# EAGLE design Board-Back (EAGLE 9.0.1)
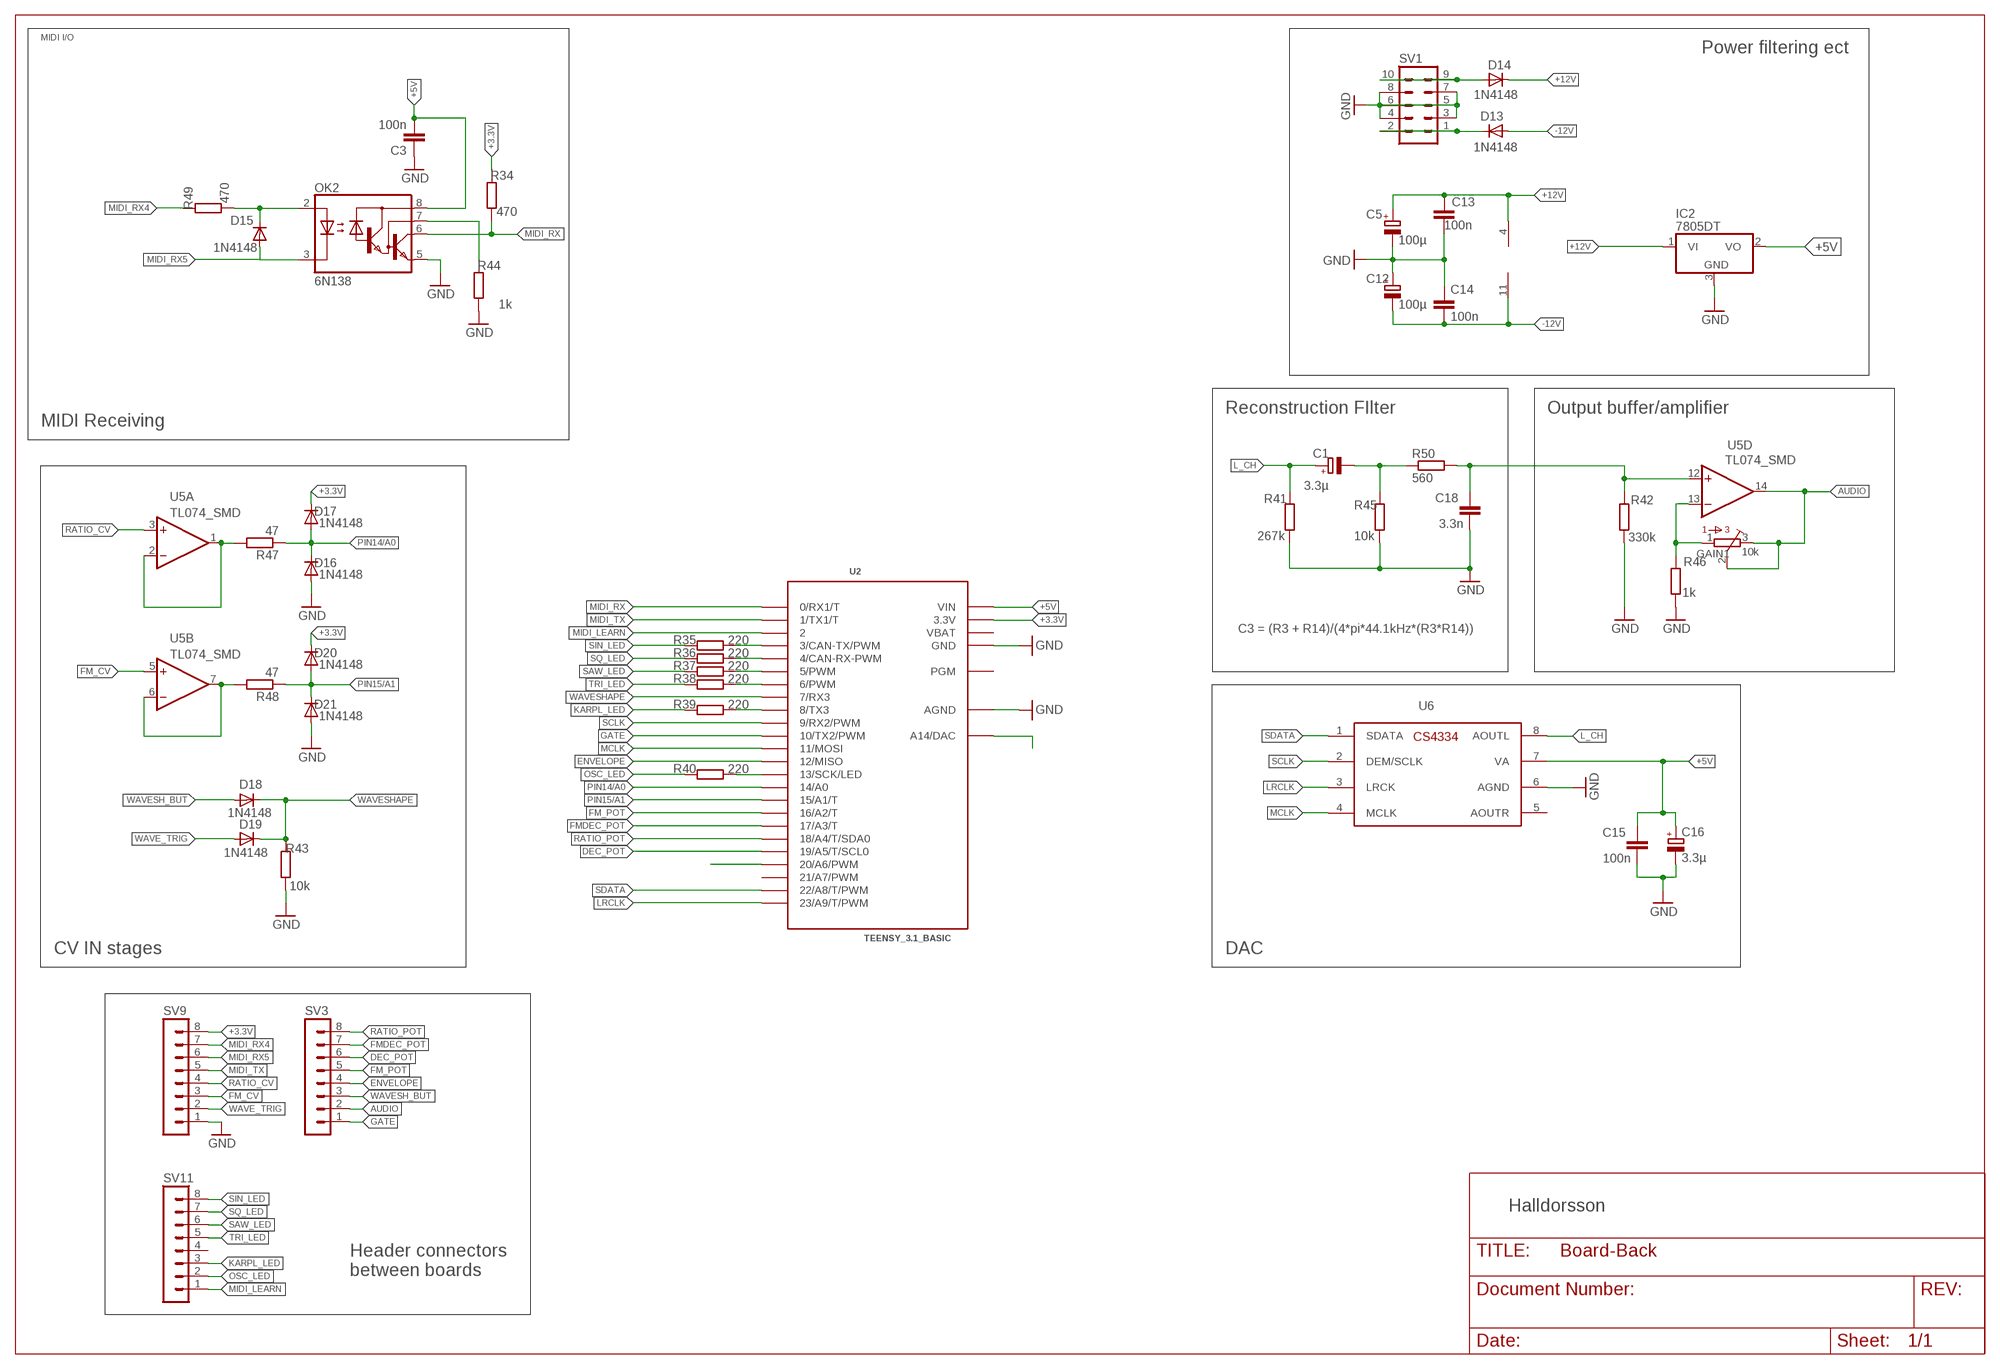
[diagram p0: schematic, sheet 1]

## Parts
C1  3.3µ  CPOL-EU153CLV-0405  [153CLV-0405]
C3  100n  C-EUC1206  [C1206]
C5  100µ  CPOL-EUE5-6  [E5-6]
C12  100µ  CPOL-EUE5-6  [E5-6]
C13  100n  C-EUC1206  [C1206]
C14  100n  C-EUC1206  [C1206]
C15  100n  C-EUC1206  [C1206]
C16  3.3µ  CPOL-EU153CLV-0505  [153CLV-0505]
C18  3.3n  C-EUC1206  [C1206]
D13  1N4148  1N4148DO35-7  [DO35-7]
D14  1N4148  1N4148DO35-7  [DO35-7]
D15  1N4148  1N4148DO35-7  [DO35-7]
D16  1N4148  1N4148DO35-7  [DO35-7]
D17  1N4148  1N4148DO35-7  [DO35-7]
D18  1N4148  1N4148DO35-7  [DO35-7]
D19  1N4148  1N4148DO35-7  [DO35-7]
D20  1N4148  1N4148DO35-7  [DO35-7]
D21  1N4148  1N4148DO35-7  [DO35-7]
GAIN1  10k  BOURNS_3362P_TRIMMERP  [BOURNS_3362P_TRIMMER]
IC2  7805DT  [TO252]
OK2  6N138  [DIL08]
R34  470  R-EU_M1206  [M1206]
R35  220  R-EU_M1206  [M1206]
R36  220  R-EU_M1206  [M1206]
R37  220  R-EU_M1206  [M1206]
R38  220  R-EU_M1206  [M1206]
R39  220  R-EU_M1206  [M1206]
R40  220  R-EU_M1206  [M1206]
R41  267k  R-EU_M1206  [M1206]
R42  330k  R-EU_M1206  [M1206]
R43  10k  R-EU_M1206  [M1206]
R44  1k  R-EU_M1206  [M1206]
R45  10k  R-EU_M1206  [M1206]
R46  1k  R-EU_M1206  [M1206]
R47  47  R-EU_M1206  [M1206]
R48  47  R-EU_M1206  [M1206]
R49  470  R-EU_M1206  [M1206]
R50  560  R-EU_M1206  [M1206]
SV1  10PIN_BACKSIDE  [10PIN_BACKSIDE]
SV3  MA08-1  [MA08-1]
SV9  MA08-1  [MA08-1]
SV11  MA08-1  [MA08-1]
U2  TEENSY_3.1_BASIC  [TEENSY_3.1_BASIC]
U5  TL074_SMD  [SO14]
U6  CS4334  [SOIC127P600X175-8N]

## Nets
+3.3V: D17.C D20.C R34.2 SV9.8 U2.3.3V U2.3.3V1(3.3V)
+5V: C3.2 C15.1 C16.+ IC2.2(VO) OK2.8(VCC) U2.VIN U6.7(VA)
+12V: C5.+ C13.1 D14.C IC2.1(VI) U5.4(P:V+)
-12V: C12.- C14.2 D13.A U5.11(P:V-)
AUDIO: GAIN1.2 GAIN1.3 SV3.2 U5.14(D:OUT)
DEC_POT: SV3.6 U2.19/A5(19/A5/T/SCL0)
ENVELOPE: SV3.4 U2.12(12/MISO)
FM_CV: SV9.3 U5.5(B:+IN)
FM_POT: SV3.5 U2.16/A2(16/A2/T)
FMDEC_POT: SV3.7 U2.17/A3(17/A3/T)
GATE: SV3.1 U2.10(10/TX2/PWM)
GND: C3.1 C5.- C12.+ C13.2 C14.1 C15.2 C16.- C18.2 D16.A D21.A IC2.3(GND) OK2.5(GND) R41.2 R42.2 R43.1 R44.1 R45.2 R46.2 SV1.3 SV1.4 SV1.5 SV1.6 SV1.7 SV1.8 SV9.1 U2.AGND U2.GND U2.GND1(GND) U6.6(AGND)
KARPL_LED: R39.2 SV11.3
L_CH: C1.+ R41.1 U6.8(AOUTL)
LRCLK: U2.23/A9(23/A9/T/PWM) U6.3(LRCK)
MCLK: U2.11(11/MOSI) U6.4(MCLK)
MIDI_LEARN: SV11.1 U2.2
MIDI_RX: OK2.6(VO) R34.1 U2.0(0/RX1/T)
MIDI_RX4: R49.2 SV9.7
MIDI_RX5: D15.A OK2.3(C) SV9.6
MIDI_TX: SV9.5 U2.1(1/TX1/T)
N$1: C1.- R45.1 R50.1
N$2: U2.A14(A14/DAC)
N$3: D13.C SV1.1 SV1.2
N$4: D15.C OK2.2(A) R49.1
N$5: OK2.7(VB) R44.2
N$6: U2.20/A6(20/A6/PWM)
N$8: GAIN1.1 R46.1 U5.13(D:-IN)
N$9: D14.A SV1.9 SV1.10
N$10: R40.1 U2.13(13/SCK/LED)
N$11: C18.1 R42.1 R50.2 U5.12(D:+IN)
N$12: R35.1 U2.3(3/CAN-TX/PWM)
N$14: R36.1 U2.4(4/CAN-RX-PWM)
N$15: R37.1 U2.5(5/PWM)
N$16: R48.2 U5.6(B:-IN) U5.7(B:OUT)
N$17: R47.2 U5.1(A:OUT) U5.2(A:-IN)
N$19: R38.1 U2.6(6/PWM)
N$22: R39.1 U2.8(8/TX3)
OSC_LED: R40.2 SV11.2
PIN14/A0: D16.C D17.A R47.1 U2.14/A0
PIN15/A1: D20.A D21.C R48.1 U2.15/A1(15/A1/T)
RATIO_CV: SV9.4 U5.3(A:+IN)
RATIO_POT: SV3.8 U2.18/A4(18/A4/T/SDA0)
SAW_LED: R37.2 SV11.6
SCLK: U2.9(9/RX2/PWM) U6.2(DEM/SCLK)
SDATA: U2.22/A8(22/A8/T/PWM) U6.1(SDATA)
SIN_LED: R35.2 SV11.8
SQ_LED: R36.2 SV11.7
TRI_LED: R38.2 SV11.5
WAVE_TRIG: D19.A SV9.2
WAVESH_BUT: D18.A SV3.3
WAVESHAPE: D18.C D19.C R43.2 U2.7(7/RX3)
Unconnected: SV11.4 U2.21/A7(21/A7/PWM) U2.PGM U5.8(C:OUT) U5.9(C:-IN) U5.10(C:+IN) U6.5(AOUTR)

## Notes on the sheet
- MIDI I/O
- Power filtering ect
- Reconstruction FIlter | Output buffer/amplifier
- MIDI Receiving
- C3 = (R3 + R14)/(4*pi*44.1kHz*(R3*R14))
- CV IN stages | DAC
- Halldorsson
- Header connectors 
  between boards

## Power pins joined to a net without a drawn wire
VBAT: U2.VBAT

## Library data of the parts
C1 C5 C12 C16 = resistor:CPOL-EU: POLARIZED CAPACITOR, European symbol
C3 C13-C15 C18 = resistor:C-EU: CAPACITOR, European symbol
D13-D21 = diode:1N4148: DIODE high speed (Philips)
GAIN1 = MusicThingModular:BOURNS_3362P_TRIMMER: 3362 Series 1/4" Square Trimmer
IC2 = linear:78*: Positive VOLTAGE REGULATOR Source: http://cache.national.com/ds/LM/LM78L05.pdf http://www.fairchildsemi.com/ds/LM/LM7805.pdf
OK2 = optocoupler:6N138: MOTOROLA OPTO COUPLER; MF: VISHAY/TELEFUNKEN; MPN: 6N138; OC_FARNELL: 9860150; OC_NEWARK: 35K5294
R34-R50 = resistor:R-EU_: RESISTOR, European symbol
SV1 = MusicThingModular:10PIN_BACKSIDE: PIN HEADER; OC_FARNELL: unknown; OC_NEWARK: unknown
SV3 SV9 SV11 = con-lstb:MA08-1: PIN HEADER; OC_FARNELL: unknown; OC_NEWARK: unknown
U2 = Teensy_3_Series_Board_v1.0:TEENSY_3.1_BASIC: Footprint for Teensy 3.1 board using all pin connections on the outer perimeter
U5 = MusicThingModular:TL074: Generic Quad Op Amp
U6 = SOIC127P600X175-8N:CS4334

## Board
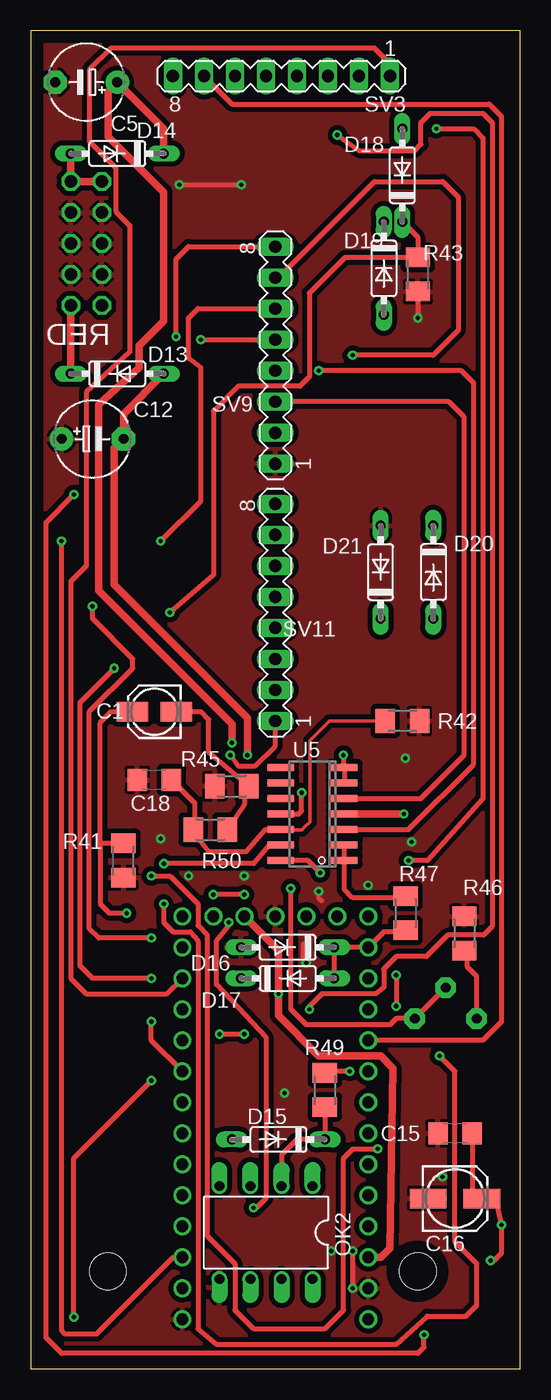
[diagram p1: board, top side]
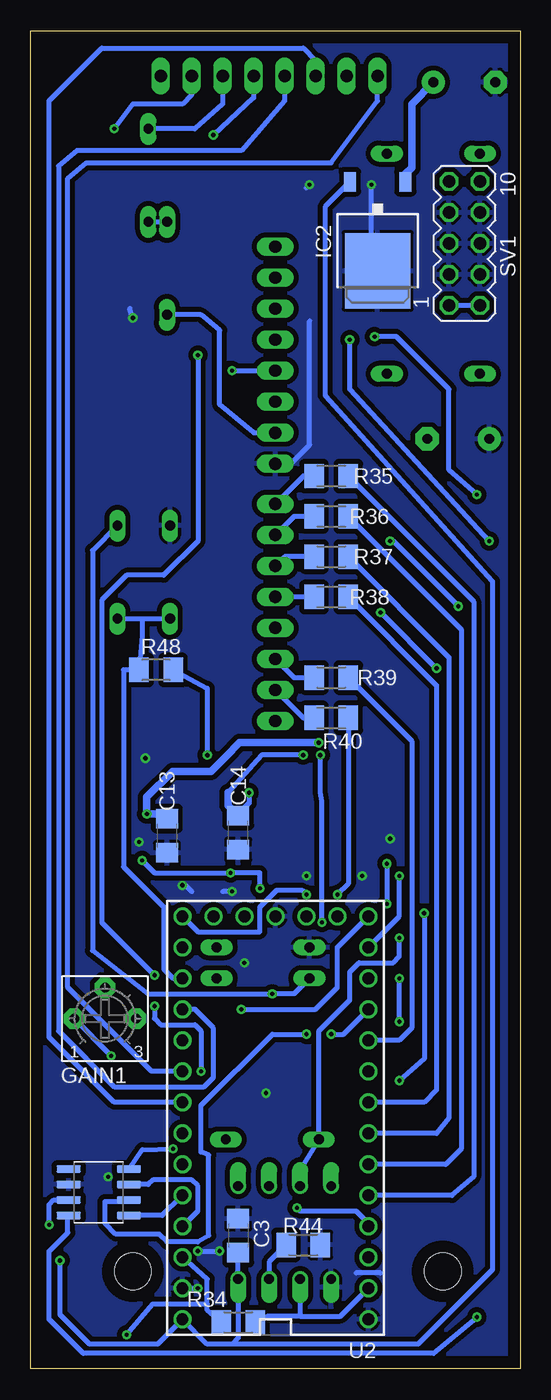
[diagram p2: board, bottom side, seen from below]

Size 40.14 x 109.65 mm. Coordinates in mm from the lower left corner, seen from the top.
Outline: 0,109.65 0,0 40.14,0 40.14,109.65 0,109.65
Copper layers (1*16): Top 0.035mm / dielectric 1.5mm / Bottom 0.035mm
Design rules "default": minimum track width 6mil, minimum drill 0.35mm, track to track 6mil, track to pad 6mil, pad to pad 6mil, via to via 6mil, smd to smd 6mil, copper to edge 40mil, drill to drill 6mil, minimum pad ring 10mil, minimum via ring 8mil, stop-mask expansion 4mil, vias tented up to drill 0mil, thermal gap 10mil
Holes 3 mm at 6.35,8 31.75,8

### Footprints (pad centres in the part's own frame; a part is rotated, then mirrored left to right if it is on the bottom)
153CLV-0405 = smd 2.6 x 1.6: + 1.8,0; - -1.8,0
C1206 = smd 1.6 x 1.8: 1 -1.4,0; 2 1.4,0
E5-6 = drill 0.813 pad 1.905: + -2.54,0 | drill 0.813 pad 1.905 octagon: - 2.54,0
153CLV-0505 = smd 3 x 1.6: + 2.2,0; - -2.2,0
DO35-7 = drill 0.813 long: A 3.81,0; C -3.81,0
BOURNS_3362P_TRIMMER = drill 0.813 pad 1.676 octagon: 1 -2.54,0; 2 0,2.54; 3 2.54,0
TO252 = smd 1 x 1.6: 1 -2.28,-4.8; 2 2.28,-4.8 | smd 5.4 x 6.2: 3 0,2.5
DIL08 = drill 0.813 offset: 1 -3.81,-3.81; 2 -1.27,-3.81; 3 1.27,-3.81; 4 3.81,-3.81; 5 3.81,3.81; 6 1.27,3.81; 7 -1.27,3.81; 8 -3.81,3.81
M1206 = smd 1.6 x 2: 1 -1.4,0; 2 1.4,0
10PIN_BACKSIDE = drill 1.016 octagon: 1 -5.08,-1.27; 2 -5.08,1.27; 3 -2.54,-1.27; 4 -2.54,1.27; 5 0,-1.27; 6 0,1.27; 7 2.54,-1.27; 8 2.54,1.27; 9 5.08,-1.27; 10 5.08,1.27
MA08-1 = drill 1.016 long: 1 -8.89,0; 2 -6.35,0; 3 -3.81,0; 4 -1.27,0; 5 1.27,0; 6 3.81,0; 7 6.35,0; 8 8.89,0
TEENSY_3.1_BASIC = drill 0.965: 0 -7.62,13.97; 1 -7.62,11.43; 2 -7.62,8.89; 3 -7.62,6.35; 3.3V 7.62,11.43; 3.3V1 -2.54,-16.51; 4 -7.62,3.81; 5 -7.62,1.27; 6 -7.62,-1.27; 7 -7.62,-3.81; 8 -7.62,-6.35; 9 -7.62,-8.89; 10 -7.62,-11.43; 11 -7.62,-13.97; 12 -7.62,-16.51; 13 7.62,-16.51; 14/A0 7.62,-13.97; 15/A1 7.62,-11.43; 16/A2 7.62,-8.89; 17/A3 7.62,-6.35; 18/A4 7.62,-3.81; 19/A5 7.62,-1.27; 20/A6 7.62,1.27; 21/A7 7.62,3.81; 22/A8 7.62,6.35; 23/A9 7.62,8.89; A14 5.08,-16.51; AGND 7.62,13.97; GND -7.62,16.51; GND1 0,-16.51; PGM 2.54,-16.51; VBAT -5.08,-16.51; VIN 7.62,16.51
SO14 = smd 0.6 x 2.2: 1 -3.81,-2.6; 2 -2.54,-2.6; 3 -1.27,-2.6; 4 0,-2.6; 5 1.27,-2.6; 6 2.54,-2.6; 7 3.81,-2.6; 8 3.81,2.6; 9 2.54,2.6; 10 1.27,2.6; 11 0,2.6; 12 -1.27,2.6; 13 -2.54,2.6; 14 -3.81,2.6
SOIC127P600X175-8N = smd 1.97 x 0.6: 1 -2.475,1.905; 2 -2.475,0.635; 3 -2.475,-0.635; 4 -2.475,-1.905; 5 2.475,-1.905; 6 2.475,-0.635; 7 2.475,0.635; 8 2.475,1.905

### Placement (x,y rotation side)
C1  10.16,53.85 180 top
C3  23.11,10.92 270 bottom
C5  4.57,105.41 180 top
C12  5.08,76.2 0 top
C13  28.96,43.69 270 bottom
C14  23.11,43.94 90 bottom
C15  34.8,19.3 180 top
C16  34.8,13.97 0 top
C18  10.16,48.26 180 top
D13  7.11,81.53 0 top
D14  7.11,99.57 180 top
D15  20.32,18.8 180 top
D16  21.08,34.54 180 top
D17  21.08,32 0 top
D18  30.48,97.79 90 top
D19  28.96,90.17 270 top
D20  33.02,65.28 270 top
D21  28.7,65.28 90 top
GAIN1  34.04,28.7 0 bottom
IC2  11.68,92.46 180 bottom
OK2  19.3,11.18 180 top
R34  23.11,3.81 180 bottom
R35  15.49,73.15 180 bottom
R36  15.49,69.85 180 bottom
R37  15.49,66.55 180 bottom
R38  15.49,63.25 180 bottom
R39  15.49,56.64 180 bottom
R40  15.49,53.34 180 bottom
R41  7.62,41.66 270 top
R42  30.48,53.09 0 top
R43  31.75,89.66 90 top
R44  17.78,10.16 180 bottom
R45  16.51,47.75 180 top
R46  35.56,35.69 90 top
R47  30.73,37.34 90 top
R48  29.84,57.28 0 bottom
R49  24.13,22.86 90 top
R50  14.73,44.2 180 top
SV1  4.57,92.2 90 top
SV3  20.57,105.92 180 top
SV9  20.07,83.06 90 top
SV11  20.07,61.98 90 top
U2  20.07,20.57 180 bottom
U5  23.11,45.47 90 top
U6  34.54,14.48 180 bottom

### Tracks (layer width: path | path; a pad name or v marks a point on that pad's centre or on a via)
+3.3V  (via drill 0.35)
  Top 0.406: v3.56,71.63 1.27,69.34 1.27,2.54 2.54,1.27 31.75,1.27 32.26,1.78 v32.26,2.79 | v11.94,84.58 11.94,90.93 12.95,91.95 SV9.8
  Top 0.61: U2.3.3V1 20.32,34.29 v20.32,30.73 20.32,28.96 23.62,25.65 28.7,25.65 29.72,24.64 29.46,9.91 28.7,9.14 U2.3.3V
  Bottom 0.406: R34.2 25.65,4.83 25.65,5.33 | 25.65,5.33 25.65,7.37 U2.3.3V | v3.56,71.63 5.84,73.66 5.84,80.26 10.16,84.58 v11.94,84.58 | D20.C 35.05,67.06 35.05,34.29 30.48,30.73 v20.32,30.73 18.54,30.73 D17.C | v32.26,2.79 30.1,5.33 25.65,5.33
+5V  (via drill 0.35)
  Top 0.406: C15.1 36.2,13.5 C16.+ 38.1,13.97 v38.61,11.81 38.61,9.48 38.01,8.89 v37.72,8.89
  Bottom 0.406: 23.62,2.03 23.11,2.54 OK2.8 C3.2 | 23.62,2.03 25.65,2.03 U2.VIN 29.72,2.03 35.31,2.03 37.72,4.45 v37.72,8.89 | IC2.2 16,95.22 16,79.76 2.29,64.52 2.29,8.13 8.38,2.03 23.62,2.03 | v38.61,11.81 38.61,13.46 38.23,13.84 U6.7
+12V  (via drill 0.35)
  Top 0.61: v30.61,45.47 U5.4 | v16.51,51.31 16.51,52.83 5.59,63.75 5.59,78.99 8.89,82.04 8.89,83.82 10.92,85.85 10.92,96.39 6.35,100.97 6.35,104.65 C5.+ 10.92,101.6 D14.C
  Bottom 0.406: C13.1 28.58,45.47
  Bottom 0.61: 28.58,45.47 v30.61,45.47 30.61,46.86 28.5,48.97 25.33,48.97 24.59,49.7 24.13,50.16 22.99,51.31 v16.51,51.31 | IC2.1 9.4,97.91 8.89,98.42 8.89,103.63 C5.+
-12V  (via drill 0.35)
  Top 0.406: U5.11 21.97,45.47 22.23,45.72 v22.23,47.21
  Top 0.61: v17.78,50.29 17.78,53.34 6.86,64.26 6.86,75.44 C12.- 7.62,78.23 D13.A
  Bottom 0.406: v17.78,50.29 21.21,50.29 23.94,47.24 | 23.17,45.4 C14.2 23.11,45.47 22.23,46.35 v22.23,47.21
  Bottom 0.61: 23.94,47.24 23.94,46.17 23.17,45.4
AUDIO  (via drill 0.35)
  Top 0.406: GAIN1.2 GAIN1.3 29.97,28.7 29.46,28.19 22.61,28.19 21.34,29.46 v21.34,39.37 | v23.75,40.64 22.73,41.66 20.57,41.66 20.57,41.6 U5.14 | v33.27,101.6 36.32,101.6 37.08,100.84 37.08,46.74 32.51,41.66 v30.99,41.66
  Bottom 0.406: v21.34,39.37 21.34,40.64 v23.75,40.64 29.97,40.64 v30.99,41.66 | SV3.2 26.92,104.39 27.69,103.63 31.75,103.63 v33.27,101.6
DEC_POT
  Bottom 0.406: U2.19/A5 33.27,21.84 38.61,27.18 38.61,103.89 34.29,108.2 17.78,108.2 16.76,107.19 SV3.6
ENVELOPE  (via drill 0.35)
  Top 0.406: v25.15,101.09 26.92,99.82 31.5,99.82 32,100.33 32,102.11 32.77,102.87 37.08,102.87 37.85,102.11 37.85,36.26 37.15,35.56 34.23,35.56 32.45,33.78 29.97,33.78 28.96,32.77 28.96,31.24 28.32,30.73 23.88,30.73 22.86,29.72 v22.86,29.46
  Bottom 0.406: SV3.4 21.84,104.14 v25.15,101.09 | v22.86,29.46 16.76,29.46 14.99,31.24 14.99,34.54 U2.12
FM_CV
  Top 0.406: U5.5 32,46.74 35.56,50.29 35.56,77.98 34.29,79.25 SV9.3
FM_POT
  Bottom 0.406: SV3.5 19.3,103.89 22.86,99.82 36.32,99.82 37.85,98.55 37.85,27.69 33.27,23.11 25.91,23.11 25.15,23.88 25.15,27.94 26.67,29.46 U2.16/A2
FMDEC_POT
  Top 0.406: SV3.7 16.51,103.63 37.59,103.63 38.61,102.62 38.61,28.45 37.08,26.92 U2.17/A3
GATE
  Top 0.406: SV3.1 29.46,106.93 28.19,108.2 6.6,108.2 4.83,106.43 4.83,100.58 6.99,98.42 6.99,94.82 8.13,93.67 8.13,83.31 4.57,80.01 4.57,65.79 3.3,64.52 3.3,32 4.57,30.73 11.18,30.73 U2.10
GND  (via drill 0.35)
  Top 0.406: R43.1 v31.75,86.11 | v12.19,97.03 v17.27,97.03 | v26.42,6.6 v26.42,9.65 | 23.62,38.61 23.88,38.35 | 22.35,34.8 22.35,33.78
  Bottom 0.406: v31.75,86.11 32,86.87 | 11.43,7.87 13.46,7.87 | SV9.1 18.8,74.17 17.27,75.69 17.27,85.85 | IC2.3 12.19,90.46 v12.19,97.03 | v17.27,97.03 17.53,96.77 | U2.AGND v26.42,6.6 | v26.42,9.65 v24.64,9.65 | v23.62,39.12 24.38,39.12 | 26.92,39.12 27.43,39.62
  other vias: 10.67,43.43 31.24,43.18 30.73,50.04 12.95,40.39 17.53,40.39 33.78,15.75 22.61,33.27 20.83,22.61 27.69,39.62
  pour Bottom (isolate 0.406): -0.76,110.49 40.64,110.49 40.64,-0.76 -0.76,-0.76
  pour Top (isolate 0.406): -1.27,111.25 41.4,111.25 41.4,-1.52 -1.27,-1.52
KARPL_LED
  Bottom 0.406: SV11.3 18.54,56.64 R39.2
L_CH  (via drill 0.35)
  Top 0.406: 5.71,43.05 5.71,38.1 6.48,37.34 v7.87,37.34 | R41.1 6.74,43.06 5.71,43.05 | 5.71,43.05 5.71,52.96 6.6,53.85 C1.+ | v3.56,4.25 3.56,17.27 v9.91,23.62
  Bottom 0.406: v7.87,37.34 7.87,25.4 v9.91,23.62 | v3.56,4.25 7.11,1.27 35.81,1.27 38.61,4.06 38.61,9.65 37.08,11.18 37.08,12.57 U6.8
LRCLK
  Bottom 0.406: U2.23/A9 26.42,12.95 26.42,14.99 26.92,15.49 30.1,15.49 30.48,15.11 U6.3
MCLK  (via drill 0.35)
  Top 0.406: v9.91,40.39 11.43,40.39 13.72,38.1 13.72,36.32 14.48,35.56 14.48,10.92 16.76,8.64 16.76,4.83 18.29,3.3 24.13,3.3 25.65,4.83 25.65,17.27 26.42,18.03 v28.45,18.03
  Bottom 0.406: U6.4 30.99,17.97 v28.45,18.03 | U2.11 9.91,37.08 v9.91,40.39
MIDI_LEARN  (via drill 0.35)
  Top 0.406: v16.26,36.58 16.26,36.32 15.24,35.05 15.24,31.5 19.3,27.18 19.3,13.97 18.54,13.21 v18.29,13.21 | v16.38,50.29 17.02,49.4 18.41,49.4 20.07,51.05 SV11.1
  Bottom 0.406: v16.26,36.58 16.26,46.48 16.38,47.24 v16.38,50.29 | v18.29,13.21 18.03,12.95 13.46,12.95 12.45,11.94 U2.2
MIDI_RX
  Bottom 0.406: OK2.6 18.03,4.32 | 18.03,4.32 14.73,4.32 U2.0 | 18.03,4.32 20.7,4.32 R34.1
MIDI_RX4  (via drill 0.35)
  Top 0.406: SV9.7 20.32,89.41 28.19,97.28 33.78,97.28 35.05,96.01 35.05,85.09 33.02,83.06 v26.42,83.06 26.16,83.06 | v29.97,32.26 v29.97,29.72 | v26.16,24.38 24.25,24.38 R49.2
  Bottom 0.406: v26.42,83.06 26.42,67.82 29.21,65.02 32.26,65.02 34.29,62.99 34.29,36.58 v29.97,32.26 | v29.97,29.72 29.97,28.7 29.46,28.19 26.67,28.19 26.16,27.69 v26.16,24.38
MIDI_RX5  (via drill 0.35)
  Top 0.406: v9.91,35.31 5.59,35.31 4.83,36.07 4.83,53.85 8.38,57.4 8.38,58.17 5.08,61.47 v5.08,62.48 | v10.67,67.82 13.97,71.12 13.97,82.04 12.95,82.8 12.95,86.11 13.72,86.87 SV9.6
  Bottom 0.406: OK2.3 18.03,16.26 D15.A 16.51,27.69 13.97,30.23 13.97,32.51 13.21,33.27 10.41,33.27 9.91,33.78 v9.91,35.31 | v5.08,62.48 10.41,67.82 v10.67,67.82
MIDI_TX  (via drill 0.35)
  Top 0.406: v2.54,67.82 2.54,3.17 2.86,2.86 5.4,2.86 11.68,9.14 U2.1 12.32,9.14 | v13.97,84.33 SV9.5
  Bottom 0.406: v2.54,67.82 13.97,80.26 v13.97,84.33
N$1
  Top 0.406: R50.1 17.53,46.23 17.53,46.99 17.4,47.12 17.4,47.37 R45.1 14.61,50.55 14.61,53.21 13.97,53.85 C1.- 12.32,53.85
N$3
  Top 0.61: D13.C SV1.2
  Bottom 0.406: SV1.2 SV1.1
N$4
  Top 0.406: R49.1 D15.C 21.84,18.8 20.57,17.53 OK2.2
N$5
  Bottom 0.406: R44.2 20.57,8.77 OK2.7
N$8  (via drill 0.35)
  Top 0.406: U5.13 19.56,42.93 18.29,41.4 v10.92,41.4 | v10.92,38.1 10.92,36.58 11.68,35.81 13.08,35.81 13.72,35.05 13.72,3.3 15.24,2.03 29.97,2.03 32.51,4.32 35.69,4.32 36.58,5.21 36.58,8.64 34.8,10.41 34.8,24.38 v33.53,25.65 | GAIN1.1 36.58,32.17 35.82,32.93 35.82,34.03 R46.1
  Bottom 0.406: v10.92,41.4 v10.92,38.1 | v33.53,25.65 GAIN1.1
N$9
  Top 0.61: D14.A SV1.10 SV1.9
N$10  (via drill 0.35)
  Top 0.406: v17.53,38.86 v14.99,38.86
  Bottom 0.406: R40.1 14.09,39.75 v14.99,38.86 | U2.13 26.42,35.81 21.34,35.81 21.34,37.85 19.94,39.24 17.91,39.24 v17.53,38.86
N$11
  Top 0.305: 20.87,44.17 22.23,44.17 22.43,44.35 22.91,44.83 22.91,51.48 24.51,53.09 R42.1
  Top 0.406: 20.87,44.17 U5.12 19.24,44.2 17.72,42.42 14.61,42.42 13.46,43.82 13.46,44.96 | R50.2 13.46,44.96 | C18.1 13.46,46.36 13.46,44.96
N$12
  Bottom 0.406: R35.1 3.81,62.87 3.81,15.75 5.59,14.22 U2.3
N$14
  Bottom 0.406: R36.1 4.83,60.58 4.83,18.03 6.1,16.76 U2.4
N$15
  Bottom 0.406: R37.1 5.84,58.3 5.84,20.57 6.86,19.3 U2.5
N$16  (via drill 0.35)
  Top 0.406: v25.65,50.29 25.65,49.34 U5.7 U5.6
  Bottom 0.406: R48.2 25.65,55.75 v25.65,50.29
N$17
  Top 0.406: R47.2 31.24,38.61 26.4,38.61 25.71,39.3 U5.1 U5.2
N$19
  Bottom 0.406: R38.1 6.86,56.01 6.86,22.86 7.87,21.84 U2.6
N$22
  Bottom 0.406: R39.1 8.89,51.44 8.89,27.94 9.91,26.92 U2.8
OSC_LED
  Bottom 0.406: SV11.2 17.78,53.34 R40.2
PIN14/A0
  Top 0.406: R47.1 31.12,35.81 28.96,35.81 U2.14/A0 D16.C D17.A
PIN15/A1
  Bottom 0.406: D20.A 30.99,61.47 | 30.99,61.47 D21.C | 30.99,61.47 30.99,60.07 R48.1 32.51,57.28 32.51,41.15 29.21,37.85 29.21,32.77 28.45,32 U2.15/A1
RATIO_CV  (via drill 0.35)
  Top 0.406: U5.3 30.99,44.2 36.32,49.53 36.32,80.77 35.31,81.79 v23.62,81.79
  Bottom 0.406: v23.62,81.79 SV9.4
RATIO_POT
  Bottom 0.406: U2.18/A4 30.23,24.38 37.08,31.24 37.08,97.54 35.56,98.81 15.49,98.81 11.68,103.89 SV3.8
SAW_LED
  Bottom 0.406: R37.2 19.3,66.55 SV11.6
SCLK  (via drill 0.35)
  Top 0.406: v17.53,27.43 v15.49,27.43
  Bottom 0.406: v17.53,27.43 20.32,27.43 26.16,21.59 26.16,17.78 25.53,17.53 25.53,10.92 26.42,10.41 28.96,10.41 29.59,11.05 33.15,11.05 34.04,11.94 34.04,13.72 32.2,13.72 U6.2 | v15.49,27.43 14.48,27.43 U2.9
SDATA
  Bottom 0.406: U2.22/A8 27.81,14.1 29.34,12.57 U6.1
SIN_LED
  Bottom 0.406: R35.2 17.78,73.15 SV11.8
SQ_LED
  Bottom 0.406: R36.2 18.54,69.85 SV11.7
TRI_LED
  Bottom 0.406: R38.2 SV11.5
WAVE_TRIG
  Bottom 0.406: D19.A 26.16,86.36 24.64,85.09 24.64,78.99 21.84,76.71 SV9.2
WAVESH_BUT
  Bottom 0.406: SV3.3 24.38,103.63 26.67,101.6 D18.A
WAVESHAPE  (via drill 0.35)
  Top 0.406: D18.C 31.75,92.71 R43.2 25.78,91.06 22.86,88.14 22.86,81.28 22.1,80.52 17.02,80.52 14.99,78.49 14.99,65.02 v11.43,61.98 | v6.86,57.4 4.06,54.61 4.06,33.02 5.08,32 v9.91,32 | U2.7 9.91,26.92 v9.91,28.45
  Bottom 0.406: D18.C D19.C | v11.43,61.98 v6.86,57.4 | v9.91,28.45 v9.91,32

### Text on the board
tPlace: RED